# EAGLE design usbif2 (EAGLE 6.5.0)
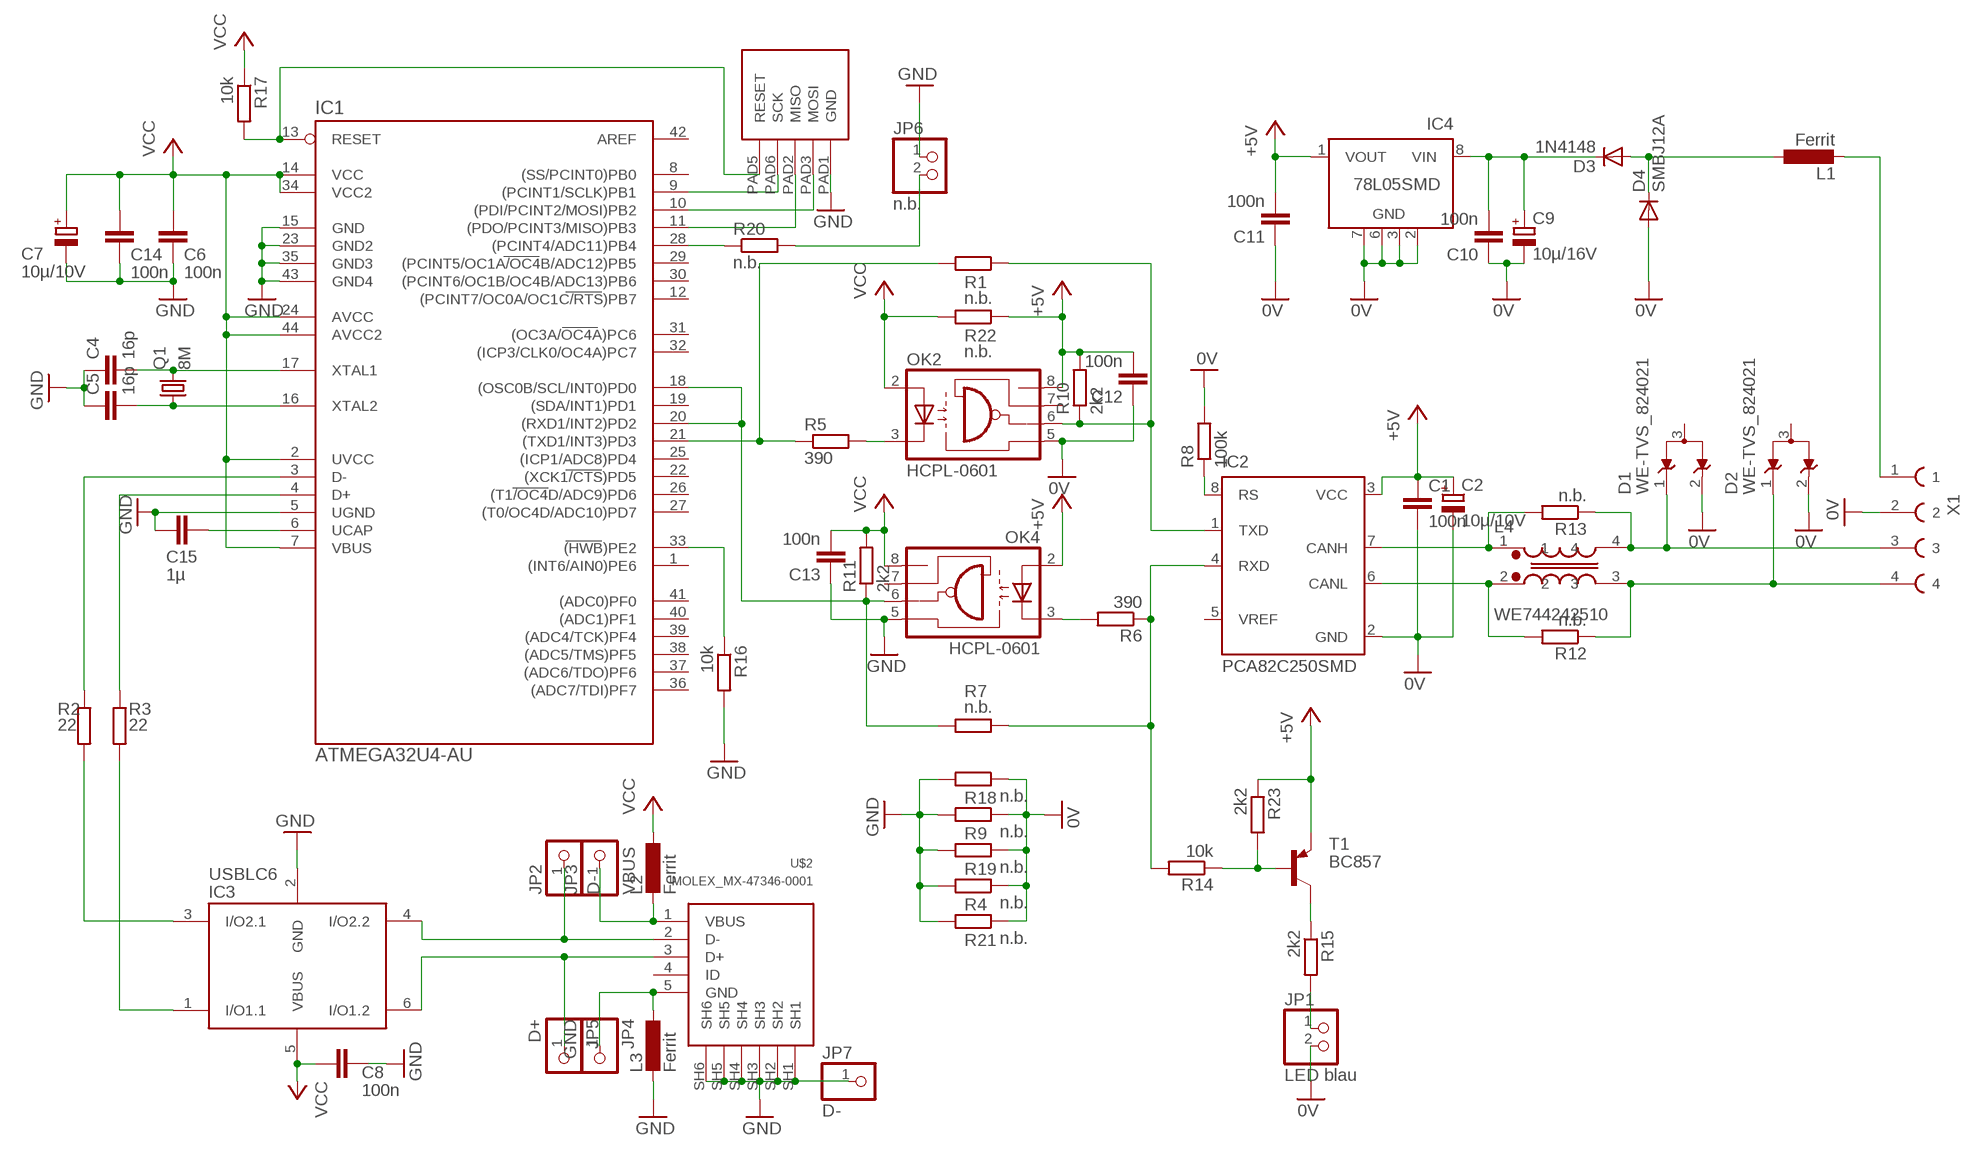
[diagram p0: schematic, sheet 1]

## Parts
C1  100n  C-EUC0603  [C0603]
C2  10µ/10V  CPOL-EUA/3216-18W  [A/3216-18W]
C4  16p  C-EUC0603  [C0603]
C5  16p  C-EUC0603  [C0603]
C6  100n  C-EUC0603  [C0603]
C7  10µ/10V  CPOL-EUA/3216-18W  [A/3216-18W]
C8  100n  C-EUC0603  [C0603]
C9  10µ/16V  CPOL-EUA/3216-18W  [A/3216-18W]
C10  100n  C-EUC0603  [C0603]
C11  100n  C-EUC0603  [C0603]
C12  100n  C-EUC0603  [C0603]
C13  100n  C-EUC0603  [C0603]
C14  100n  C-EUC0603  [C0603]
C15  1µ  C-EUC1210K  [C1210K]
D1  WE-TVS_824021  [WE-TVS_SOT23-3L]
D2  WE-TVS_824021  [WE-TVS_SOT23-3L]
D3  1N4148  DIODE-SOD80C  [SOD80C]
D4  SMBJ12A  DIODE-SMB  [SMB]
IC1  ATMEGA32U4-AU  [TQFP44]
IC2  PCA82C250SMD  [SO8]
IC3  USBLC6  [SOT23-6L]
IC4  78L05SMD  [SO08]
JP1  LED blau  PINHD-1X2  [1X02]
JP2  D-  PINHD-1X1  [1X01]
JP3  VBUS  PINHD-1X1  [1X01]
JP4  GND  PINHD-1X1  [1X01]
JP5  D+  PINHD-1X1  [1X01]
JP6  n.b.  PINHD-1X2  [1X02]
JP7  D-  PINHD-1X1  [1X01]
L1  Ferrit  L-EUL1806  [L1806]
L2  Ferrit  L-EUL1806  [L1806]
L3  Ferrit  L-EUL1806  [L1806]
L4  WE744242510  WE-SLM  [WE-SLM]
OK2  HCPL-0601  HCPL0601  [SOIC08]
OK4  HCPL-0601  HCPL0601  [SOIC08]
Q1  8M  CRYSTALSM49  [SM49]
R1  n.b.  R-EU_MELF0204R  [MINI_MELF-0204R]
R2  22  R-EU_R0603  [R0603]
R3  22  R-EU_R0603  [R0603]
R4  n.b.  R-EU_MELF0204R  [MINI_MELF-0204R]
R5  390  R-EU_R0603  [R0603]
R6  390  R-EU_R0603  [R0603]
R7  n.b.  R-EU_MELF0204R  [MINI_MELF-0204R]
R8  100k  R-EU_R0603  [R0603]
R9  n.b.  R-EU_MELF0204R  [MINI_MELF-0204R]
R10  2k2  R-EU_R0603  [R0603]
R11  2k2  R-EU_R0603  [R0603]
R12  n.b.  R-EU_R0603  [R0603]
R13  n.b.  R-EU_R0603  [R0603]
R14  10k  R-EU_R0603  [R0603]
R15  2k2  R-EU_R0603  [R0603]
R16  10k  R-EU_R0603  [R0603]
R17  10k  R-EU_R0603  [R0603]
R18  n.b.  R-EU_MELF0204R  [MINI_MELF-0204R]
R19  n.b.  R-EU_MELF0204R  [MINI_MELF-0204R]
R20  n.b.  R-EU_R0603  [R0603]
R21  n.b.  R-EU_MELF0204R  [MINI_MELF-0204R]
R22  n.b.  R-EU_MELF0204R  [MINI_MELF-0204R]
R23  2k2  R-EU_R0603  [R0603]
T1  BC857  BC807  [SOT323-BEC]
U$1  ATMEL_ISP  [ATMEL_ISP]
U$2  MOLEX_MX-47346-0001  [MOLEX_MX-47346-0001]
X1  DEGSON_15EDGRC-3.5_4  [DEGSON_15EDGRC-3.5_4]

## Nets
0V: C1.2 C2.- C9.- C10.1 C11.1 C12.1 D1.2 D2.2 D4.A IC2.2(GND) IC4.2(GND) IC4.3(GND) IC4.6(GND) IC4.7(GND) JP1.2 OK2.5(GND) R4.1 R8.2 R9.1 R18.1 R19.1 R21.1 X1.2
#RESET: IC1.13(RESET) R17.2 U$1.PAD5(RESET)
+5V: C1.1 C2.+ C11.2 C12.2 IC2.3(VCC) IC4.1(VOUT) OK2.8(VCC) OK4.2(A) R10.2 R22.1 R23.1 T1.E
+12V: L1.2 X1.1
B+: D1.1 L4.4 R13.1 X1.3
B-: D2.1 L4.3 R12.1 X1.4
D+: IC3.6(I/O1.2) JP5.1 U$2.3(D+)
D-: IC3.4(I/O2.2) JP2.1 U$2.2(D-)
GND: C4.1 C5.1 C6.1 C7.- C8.1 C13.1 C14.1 C15.2 IC1.5(UGND) IC1.15(GND) IC1.23(GND2) IC1.35(GND3) IC1.43(GND4) IC3.2(GND) JP6.1 JP7.1 L3.2 OK4.5(GND) R4.2 R9.2 R16.2 R18.2 R19.2 R21.2 U$1.PAD1(GND) U$2.SH1 U$2.SH2 U$2.SH3 U$2.SH4 U$2.SH5 U$2.SH6
N$1: OK2.3(C) R5.2
N$2: IC1.18((OSC0B/SCL/INT0)PD0) IC1.20((RXD1/INT2)PD2) OK4.6(VO) R7.2 R11.1
N$3: IC2.1(TXD) OK2.6(VO) R1.1 R10.1
N$4: IC2.4(RXD) R6.1 R7.1 R14.2
N$5: IC1.10((PDI/PCINT2/MOSI)PB2) U$1.PAD3(MOSI)
N$6: IC1.11((PDO/PCINT3/MISO)PB3) U$1.PAD2(MISO)
N$7: IC1.9((PCINT1/SCLK)PB1) U$1.PAD6(SCK)
N$9: IC1.4(D+) R3.1
N$10: IC2.7(CANH) L4.1 R13.2
N$11: C15.1 IC1.6(UCAP)
N$12: IC1.3(D-) R2.1
N$13: IC3.1(I/O1.1) R3.2
N$14: IC3.3(I/O2.1) R2.2
N$15: C4.2 IC1.17(XTAL1) Q1.2
N$16: C5.2 IC1.16(XTAL2) Q1.1
N$17: IC2.6(CANL) L4.2 R12.2
N$18: JP6.2 R20.2
N$19: IC1.28((PCINT4/ADC11)PB4) R20.1
N$20: D3.A D4.C L1.1
N$21: C9.+ C10.2 D3.C IC4.8(VIN)
N$22: OK4.3(C) R6.2
N$23: R15.1 T1.C
N$24: IC1.33((HWB)PE2) R16.1
N$25: R14.1 R23.2 T1.B
N$26: JP1.1 R15.2
N$27: IC2.8(RS) R8.1
N$29: JP4.1 L3.1 U$2.5(GND)
N$30: IC1.21((TXD1/INT3)PD3) R1.2 R5.1
VBUS: JP3.1 L2.2 U$2.1(VBUS)
VCC: C6.2 C7.+ C8.2 C13.2 C14.2 IC1.2(UVCC) IC1.7(VBUS) IC1.14(VCC) IC1.24(AVCC) IC1.34(VCC2) IC1.44(AVCC2) IC3.5(VBUS) L2.1 OK2.2(A) OK4.8(VCC) R11.2 R17.1 R22.2
Unconnected: D1.3(GND) D2.3(GND) IC1.1((INT6/AIN0)PE6) IC1.8((SS/PCINT0)PB0) IC1.12((PCINT7/OC0A/OC1C/RTS)PB7) IC1.19((SDA/INT1)PD1) IC1.22((XCK1/CTS)PD5) IC1.25((ICP1/ADC8)PD4) IC1.26((T1/OC4D/ADC9)PD6) IC1.27((T0/OC4D/ADC10)PD7) IC1.29((PCINT5/OC1A/OC4B/ADC12)PB5) IC1.30((PCINT6/OC1B/OC4B/ADC13)PB6) IC1.31((OC3A/OC4A)PC6) IC1.32((ICP3/CLK0/OC4A)PC7) IC1.36((ADC7/TDI)PF7) IC1.37((ADC6/TDO)PF6) IC1.38((ADC5/TMS)PF5) IC1.39((ADC4/TCK)PF4) IC1.40((ADC1)PF1) IC1.41((ADC0)PF0) IC1.42(AREF) IC2.5(VREF) IC4.4(NC) IC4.5(NC) OK2.7(VE) OK4.7(VE) U$2.4(ID)

## Library data of the parts
C1 C4-C6 C8 C10-C15 = resistor:C-EU: CAPACITOR, European symbol
C2 C7 C9 = rcl:CPOL-EU: POLARIZED CAPACITOR, European symbol
D1 D2 = EagleLibrary_Wuerth_Elektronik_eiSos_V6_20140807:WE-TVS_824021: TVS Diode Array WE-TVS, Standard Series - Low capazity - No leakage current - Low clamping voltage - high ESD voltage protection - Uni- and bidirectional protection -- DC Distribution -- Headsets and Accessoires -- PDAs -- Digital Cameras -- MP3-Players -- Touch Panels <http://katalog.we-online.de/media/images/eisos/VarTVS_highspeed_pf2.jpg.jpg> Details see: http://katalog.we-online.de/en/pbs/WE-TVS_High_Speed? Updated by Dan Xu 2014-07-11 2014 (C) Würth Elektronik
D3 D4 = diode:DIODE-: DIODE
IC1 = mega32U4:ATMEGA32U4-AU: ATMega32U4-AU Library by: http://projects.weber-itam.de
IC2 = mylib:PCA82C250: CAN CONTROLLER INTERFACE
IC3 = mylib:USBLC6
IC4 = linear:78L*SMD: Positive VOLTAGE REGULATOR
JP1 JP6 = pinhead:PINHD-1X2: PIN HEADER
JP2-JP5 JP7 = pinhead:PINHD-1X1: PIN HEADER
L1-L3 = mylib:L-EU: INDUCTOR, European symbol
L4 = EagleLibrary_Wuerth_Elektronik_eiSos_V6_20140807:WE-SLM: SMD Common Mode Line Filter WE-SLM - Small size - Low Profile - High Impedance - High current capability up to 300 mA -- USB -- CAN -- Firewire -- Data Lines -- Power supply systems -- Signal Lines <http://katalog.we-online.de/media/images/eisos/IndSLM_pf2.jpg> Details see: http://katalog.we-online.de/en/pbs/WE-SLM?? Updated by Dan Xu 2014-07-11 2014 (C) Würth Elektronik
OK2 OK4 = optocoupler:HCPL0601: HEWLETT PACKARD OPTO COUPLER; MF: AGILENT TECHNOLOGIES; MPN: HCPL-0601-000E; OC_FARNELL: 9995102; OC_NEWARK: 88H7776
Q1 = crystal:CRYSTAL: CRYSTAL; OC_FARNELL: unknown; OC_NEWARK: unknown
R1-R23 = resistor:R-EU_: RESISTOR, European symbol
T1 = mylib:BC807
U$1 = mylib:ATMEL_ISP
U$2 = mylib:MOLEX_MX-47346-0001
X1 = mylib:DEGSON_15EDGRC-3.5_4

## Net classes
0 default: clearance 0.205 mm

## Board
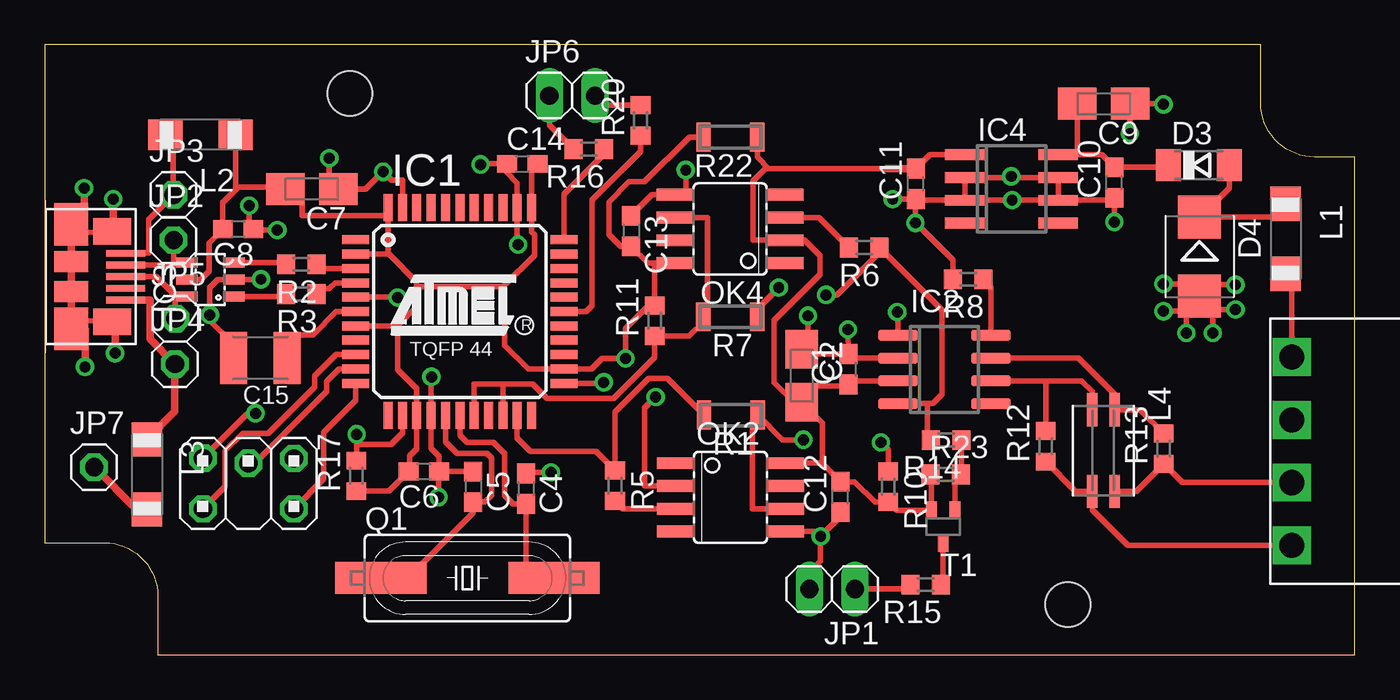
[diagram p1: board, top side]
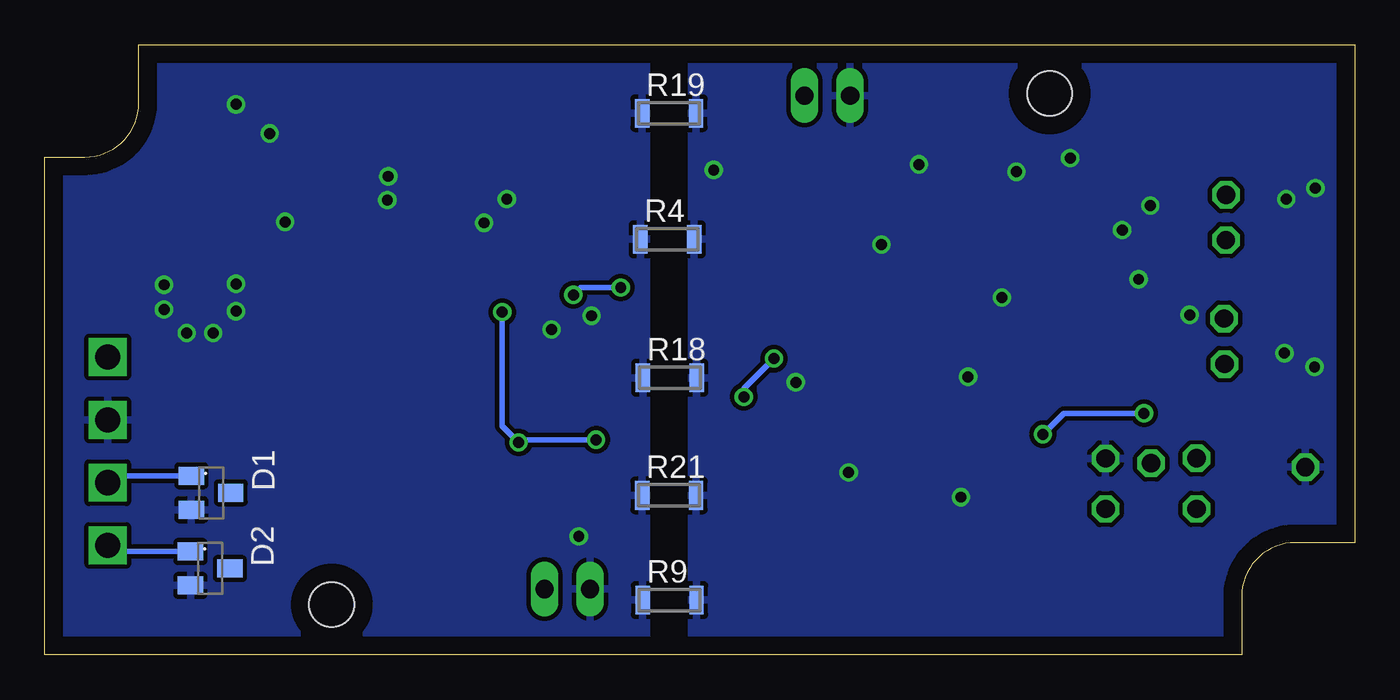
[diagram p2: board, bottom side, seen from below]

Size 72.98 x 34 mm. Coordinates in mm from the lower left corner, seen from the top.
Outline: 0,34 0,6.25 3.3,6.25 arc-90 6.3,3.25 6.3,0 72.98,0 72.98,27.75 70.75,27.75 arc-90 67.75,30.75 67.75,34 0,34
Copper layers (1*16): Top 0.035mm / dielectric 1.5mm / Bottom 0.035mm
Design rules "Bilex DRU": minimum track width 10mil, minimum drill 24mil, track to track 10mil, track to pad 10mil, pad to pad 10mil, via to via 10mil, smd to smd 10mil, copper to edge 40mil, drill to drill 8mil, minimum pad ring 10mil, minimum via ring 8mil, stop-mask expansion 4mil, vias tented up to drill 0mil, thermal gap 10mil
Holes 2.5 mm at 57,2.8 17,31.3

### Footprints (pad centres in the part's own frame; a part is rotated, then mirrored left to right if it is on the bottom)
C0603 = smd 1.1 x 1: 1 -0.85,0; 2 0.85,0
A/3216-18W = smd 2.15 x 1.8: + 1.475,0; - -1.475,0
C1210K = smd 1.5 x 2.9: 1 -1.5,0; 2 1.5,0
WE-TVS_SOT23-3L = smd 1 x 1.4: 1 -0.95,-1.1; 2 0.95,-1.1; 3 0,1.1
SOD80C = smd 1.4 x 1.8: A 1.7,0; C -1.7,0
SMB = smd 2.4 x 2.4: A 2.2,0; C -2.2,0
TQFP44 = smd 1.5 x 0.5: 1 -5.8,4; 2 -5.8,3.2; 3 -5.8,2.4; 4 -5.8,1.6; 5 -5.8,0.8; 6 -5.8,0; 7 -5.8,-0.8; 8 -5.8,-1.6; 9 -5.8,-2.4; 10 -5.8,-3.2; 11 -5.8,-4; 23 5.8,-4; 24 5.8,-3.2; 25 5.8,-2.4; 26 5.8,-1.6; 27 5.8,-0.8; 28 5.8,0; 29 5.8,0.8; 30 5.8,1.6; 31 5.8,2.4; 32 5.8,3.2; 33 5.8,4 | smd 0.5 x 1.5: 12 -4,-5.8; 13 -3.2,-5.8; 14 -2.4,-5.8; 15 -1.6,-5.8; 16 -0.8,-5.8; 17 0,-5.8; 18 0.8,-5.8; 19 1.6,-5.8; 20 2.4,-5.8; 21 3.2,-5.8; 22 4,-5.8; 34 4,5.8; 35 3.2,5.8; 36 2.4,5.8; 37 1.6,5.8; 38 0.8,5.8; 39 0,5.8; 40 -0.8,5.8; 41 -1.6,5.8; 42 -2.4,5.8; 43 -3.2,5.8; 44 -4,5.8
SO8 = smd 0.6 x 2.2: 1 -1.905,-2.6; 2 -0.635,-2.6; 3 0.635,-2.6; 4 1.905,-2.6; 5 1.905,2.6; 6 0.635,2.6; 7 -0.635,2.6; 8 -1.905,2.6
SOT23-6L = smd 0.55 x 1.2: 1 -0.95,-1.3; 2 0,-1.3; 3 0.95,-1.3; 4 0.95,1.3; 5 0,1.3; 6 -0.95,1.3
SO08 = smd 0.6 x 2.2: 1 -1.905,-2.6; 2 -0.635,-2.6; 3 0.635,-2.6; 4 1.905,-2.6; 5 1.905,2.6; 6 0.635,2.6; 7 -0.635,2.6; 8 -1.905,2.6
1X02 = drill 1.016 long: 1 -1.27,0; 2 1.27,0
1X01 = drill 1.016 octagon: 1 0,0
L1806 = smd 1.9 x 1.7: 1 -0.68,0; 2 3.22,0
WE-SLM = smd 1.85 x 0.6: 1 -2.28,0.63; 2 -2.28,-0.62; 3 2.27,-0.62; 4 2.27,0.63
SOIC08 = smd 0.66 x 2.032: 1 -1.905,-3.073; 2 -0.635,-3.073; 3 0.635,-3.073; 4 1.905,-3.073; 5 1.905,3.073; 6 0.635,3.073; 7 -0.635,3.073; 8 -1.905,3.073
SM49 = smd 5.08 x 1.778: 1 -4.826,0; 2 4.826,0
MINI_MELF-0204R = smd 0.8 x 1.6: 1 -1.5,0; 2 1.5,0
R0603 = smd 1 x 1.1: 1 -0.85,0; 2 0.85,0
SOT323-BEC = smd 0.6 x 1: B -0.65,-0.9; C 0,0.9; E 0.65,-0.9
ATMEL_ISP = drill 1.016 octagon: PAD1 1.397,-2.54; PAD2 -1.41,-2.54; PAD3 1.13,0; PAD5 1.41,2.54; PAD6 -1.41,2.54
MOLEX_MX-47346-0001 = smd 2.159 x 0.381: 1 3.991,1.3; 2 3.991,0.65; 3 3.991,0; 4 3.991,-0.65; 5 3.991,-1.3 | smd 1.9 x 2.375: SH1 0.95,2.91; SH4 0.95,-2.91 | smd 1.9 x 1.175: SH2 0.95,0.84; SH3 0.95,-0.84 | smd 2.1 x 1.475: SH5 3.25,2.511; SH6 3.25,-2.511
DEGSON_15EDGRC-3.5_4 = drill 1.4 square: 1 2.15,1.2; 2 5.65,1.2; 3 9.15,1.2; 4 12.65,1.2

### Placement (x,y rotation side)
C1  44.77,15.92 90 top
C2  42.17,15.56 270 top
C4  26.81,9.26 270 top
C5  23.87,9.36 270 top
C6  21.12,10.21 180 top
C7  14.88,25.96 180 top
C8  10.77,23.72 180 top
C9  59,30.72 180 top
C10  59.59,26.32 90 top
C11  48.53,26.24 90 top
C12  44.33,8.8 90 top
C13  32.66,23.62 270 top
C14  26.61,27.37 0 top
C15  12.01,16.54 180 top
D1  63.72,9.03 270 bottom
D2  63.77,4.81 270 bottom
D3  64.3,27.3 0 top
D4  64.34,22.2 270 top
IC1  23.12,19.13 0 top
IC2  50.12,15.9 270 top
IC3  9.22,20.92 90 top
IC4  53.87,25.97 270 top
JP1  43.87,3.67 180 top
JP2  7.17,23.12 0 top
JP3  7.16,25.63 0 top
JP4  7.24,16.21 0 top
JP5  7.27,18.74 0 top
JP6  29.38,31.17 0 top
JP7  2.74,10.46 0 top
L1  69.14,24.46 270 top
L2  9.94,28.99 180 top
L3  5.69,11.33 270 top
L4  58.98,11.38 270 top
OK2  38.2,8.78 270 top
OK4  38.18,23.74 90 top
Q1  23.54,4.28 0 top
R1  38.23,13.37 180 top
R2  14.3,21.76 180 top
R3  14.3,20.11 180 top
R4  38.3,23.16 0 bottom
R5  31.78,9.42 270 top
R6  45.65,22.69 180 top
R7  38.2,18.85 180 top
R8  51.45,20.94 180 top
R9  38.17,3.06 0 bottom
R10  47,9.37 270 top
R11  33.99,18.62 90 top
R12  55.77,11.62 90 top
R13  62.34,11.49 90 top
R14  50.22,11.97 180 top
R15  49.09,3.91 180 top
R16  30.31,28.19 180 top
R17  17.36,9.97 90 top
R18  38.16,15.44 0 bottom
R19  38.2,30.18 0 bottom
R20  33.19,29.78 90 top
R21  38.2,8.89 0 bottom
R22  38.2,28.85 180 top
R23  50.19,10.06 0 top
T1  50.06,7.14 180 top
U$1  11.34,9.55 90 top
U$2  0.51,21.08 0 top
X1  68.28,18.75 270 top

### Tracks (layer width: path | path; a pad name or v marks a point on that pad's centre or on a via)
0V  (via drill 0.61)
  Top 0.305: IC4.6 59.45,25.33 | IC4.6 IC4.7 IC4.2 IC4.3 48.59,25.33 | IC2.2 45,16.54 | v44.76,18.14 C1.2 42.44,16.77 C2.- 42.52,17.38 v42.52,18.9 | IC4.6 56.47,25.35 56.44,25.35 | 51.26,25.4 51.31,25.35 v53.9,25.35 56.39,25.35 56.44,25.4 | v62.33,20.68 64.34,20.68 D4.A | v62.33,19.15 64.41,19.15 64.41,19.25 | v66.34,20.62 64.36,20.62 64.36,19.91 | v66.34,19.25 64.41,19.25 | 64.41,19.25 64.41,19.96 | v65.08,17.93 65.08,19.96 64.41,19.96 | v63.6,17.93 63.6,19.96 64.41,19.96 | 60.45,30.7 v60.45,29.06 | v62.33,30.68 62.33,30.72 C9.- | C10.1 59.59,24.23 v59.59,24.13 | C11.1 48.51,25.4 | 48.51,25.4 v47.24,25.4 | 48.51,25.4 v48.51,24.08 50.6,22 R8.2 | OK2.5 42.96,6.87 v43.23,6.6 | C12.1 44.33,7.7 v43.23,6.6 | JP1.2 42.6,4.6 43.23,5.23 v43.23,6.6
  Top 0.406: 48.59,25.33 C11.1 | 56.44,25.33 56.44,25.35 | 45,16.54 C1.2
  other vias: 53.85,26.67
  pour Bottom: 39.45,33.8 72.78,33.8 72.78,0.2 39.45,0.2
#RESET  (via drill 0.61)
  Top 0.305: U$1.PAD5 11.31,13.46 v11.73,13.46 | v17.37,12.29 17.37,11.58 | 17.37,11.58 17.37,10.84 R17.2 | IC1.13 19.93,12.36 19.3,11.73 17.53,11.73 17.37,11.58
  Bottom 0.305: v11.73,13.46 16.2,13.46 v17.37,12.29
+5V
  Top 0.305: IC4.1 49.31,27.87 C11.2 | IC2.3 44.97,15.27 | OK2.8 43.3,10.68 43.32,10.66 | 43.32,10.66 C12.2 45.11,9.65 46.24,8.52 R10.2 47.47,8.04 T1.E 49.41,10.06 R23.1 | C2.+ 42.17,14.49 42.67,14.99 44.4,14.99 44.48,15.07 C1.1 | C2.+ 43.32,12.94 43.32,10.66 | C2.+ 41.75,14.08 40.64,15.19 40.64,18.64 43.18,21.18 43.18,22.25 42.33,23.1 OK4.2 39.47,23.1 39.47,26.42 40.15,27.09 40.34,27.09 | 46.91,27.09 40.34,27.09 | R22.1 39.7,27.73 40.34,27.09
  Top 0.406: C11.2 46.91,27.09 | 44.97,15.27 C1.1
+12V
  Top 0.305: X1.1 69.48,20.9 L1.2
B+
  Top 0.305: L4.4 60.81,9.11 R13.1 63.39,9.6 X1.3
  Bottom 0.305: D1.1 69.09,9.98 X1.3
B-
  Top 0.305: X1.4 60.35,6.1 58.36,8.09 L4.3 57.42,9.11 R12.1
  Bottom 0.305: D2.1 69.14,5.76 X1.4
D+
  Top 0.305: U$2.3 6.2,21.08 7.31,19.97 IC3.6 7.27,19.97 JP5.1
D-
  Top 0.305: 7.42,21.89 7.9,21.89 IC3.4 7.92,21.73 7.32,21.73 7.17,21.73 | U$2.2 7.17,21.73 | JP2.1 7.17,21.73
GND  (via drill 0.61)
  Top 0.305: v21.95,8.79 21.95,10.21 | C4.1 26.8,10.16 v28.19,10.16 | 21.95,10.21 C6.1 21.97,11.05 21.52,11.49 IC1.15 21.52,15.48 v21.54,15.49 | 21.95,10.21 C5.1 | U$2.SH1 1.91,23.54 U$2.SH5 | U$2.SH4 1.91,18.62 U$2.SH6 | IC3.2 9.64,20.92 9.2,20.47 v9.2,18.95 9.2,18.64 10.51,17.33 C15.2 | IC1.43 19.93,26.46 19.32,26.46 v18.85,26.92 17.88,25.96 C7.- 16.26,26.52 | v24.28,27.33 24.32,27.36 C14.1 25.76,26.87 26.32,26.3 IC1.35 26.32,22.9 v26.36,22.86 | IC1.5 19.64,19.93 v19.66,19.91 | IC1.23 31.09,15.13 v31.14,15.19 | v12.04,20.93 10.57,20.93 | R16.2 28.11,29.53 JP6.1 | C13.1 33.84,25.64 OK4.5 35.71,25.64 v35.71,27.03 | 15.65,25.91 15.85,26.11 v15.85,27.69 | C8.1 11.38,23.96 v11.38,25.04 | v12.95,23.67 11.63,23.67 11.63,23.72
  Top 0.406: L3.2 5.1,8.11 JP7.1 | U$2.SH5 3.81,23.64 v3.81,25.4 | v2.18,26.01 2.18,23.99 U$2.SH1 U$2.SH2 U$2.SH3 U$2.SH4 2.23,18.17 v2.23,16.05 | U$2.SH6 arc-90 3.91,18.42 v3.91,16.82
  pour Bottom: 0.19,33.81 36.95,33.81 36.95,0.19 0.19,0.19 0.19,33.05
N$1
  Top 0.305: OK2.3 32.21,8.14 R5.2
N$2
  Top 0.305: IC1.18 23.93,15.09 25.52,15.09 | 25.52,15.09 IC1.20 | 25.52,15.09 27.18,15.09 27.99,14.28 31.7,14.28 33.98,16.56 R11.1 35.9,17.77 36.7,18.56 R7.2 36.93,18.85 36.93,24.37 OK4.6
N$3  (via drill 0.61)
  Top 0.305: OK2.6 39.42,8.14 39.42,13.06 R1.1 41.1,11.99 v42.27,11.99 | IC2.1 47.52,19.07 v47.5,19.1 | R10.1 47,11.42 v46.58,11.84
  Bottom 0.305: v47.5,19.1 47.5,12.75 v46.58,11.84 46.43,11.99 v42.27,11.99
N$4  (via drill 0.61)
  Top 0.305: IC2.4 49.17,14 | 49.17,14 49.48,14 49.99,14.51 49.99,19.21 R6.1 46.5,22.42 44.15,20.07 v43.54,20.07 | R7.1 39.7,19.27 v40.89,20.47 | R14.2 49.17,11.97 49.17,14
  Bottom 0.305: v40.89,20.47 43.13,20.47 v43.54,20.07
N$5
  Top 0.305: U$1.PAD3 11.69,10.68 15.7,14.68 15.7,15.24 16.39,15.94 IC1.10
N$6
  Top 0.305: IC1.11 17.32,14.18 15.54,12.39 15.54,9.8 U$1.PAD2
N$7
  Top 0.305: U$1.PAD6 10.06,9.39 10.06,11.38 11.02,12.34 12.45,12.34 15.04,14.94 15.04,15.54 16.23,16.73 IC1.9
N$9
  Top 0.305: IC1.4 16.16,20.73 15.85,20.42 15.46,20.42 R3.1
N$10
  Top 0.305: IC2.7 57.58,16.54 59.64,14.48 59.64,13.69 L4.1 61.02,13.66 R13.2
N$11
  Top 0.305: IC1.6 16.24,19.14 14.94,17.83 14.17,17.83 14.02,17.68 14.02,16.7 C15.1
N$12
  Top 0.305: IC1.3 15.38,21.54 R2.1
N$13
  Top 0.305: IC3.1 13.31,19.97 R3.2
N$14
  Top 0.305: IC3.3 13.35,21.87 R2.2
N$15
  Top 0.305: Q1.2 26.8,4.28 C4.2 26.08,8.41 25.6,8.89 25.6,11.23 24.99,11.84 23.52,11.84 23.12,12.23 IC1.17
N$16
  Top 0.305: IC1.16 22.32,11.86 22.96,11.23 24.64,11.23 24.89,10.97 24.89,8.89 24.51,8.51 C5.2 23.87,7.92 20.23,4.28 Q1.1
N$17
  Top 0.305: IC2.6 55.88,15.27 | 55.88,15.27 57.76,15.27 58.36,14.67 L4.2 | R12.2 55.77,15.15 55.88,15.27
N$18
  Top 0.305: R20.2 31.2,30.63 JP6.2
N$19
  Top 0.305: IC1.28 30.16,19.14 30.48,19.46 30.48,25.35 33.19,28.06 R20.1
N$20
  Top 0.305: D3.A 66,26.02 65.33,25.35 65.33,24.7 65.02,24.4 | 65.02,24.4 68.4,24.4 L1.1 | D4.C 65.02,24.4
  Top 1.016: 63.74,24.4 D4.C
N$21
  Top 0.305: 62.48,27.17 C10.2 58.89,27.87 IC4.8 57.52,27.87 C9.+
  Top 0.406: 62.48,27.17 D3.C
N$22
  Top 0.305: OK4.3 43.12,24.37 R6.2
N$23
  Top 0.305: T1.C 50.05,4.03 R15.1
N$24
  Top 0.305: IC1.33 28.93,25.67 31.16,27.91 R16.1
N$25
  Top 0.305: R14.1 51.07,10.06 R23.2 50.7,9.72 T1.B
N$26
  Top 0.305: JP1.1 47.99,3.67 R15.2
N$27
  Top 0.305: IC2.8 52.73,20.51 R8.1
N$29
  Top 0.406: U$2.5 5.86,19.78 5.86,17.59 JP4.1 7.24,13.56 L3.1
N$30
  Top 0.305: IC1.21 26.32,12.08 27.08,11.33 30.72,11.33 R5.1 31.77,13.54 33.63,15.39 34.7,15.39 R1.2
VBUS
  Top 0.305: U$2.1 5.79,22.38 5.79,24.26 JP3.1 7.16,28.55 L2.2
VCC  (via drill 0.61)
  Top 0.305: IC3.5 8.68,20.92 9.14,21.39 9.14,22.95 C8.2 9.92,25.21 10.69,25.98 | C14.2 27.12,27.03 IC1.34 27.12,23.57 27.28,23.42 27.28,22.25 25.63,20.6 | 20.73,20.52 20.73,20.78 19.17,22.34 IC1.2 19.12,22.34 IC1.44 19.12,24.49 14.33,24.49 14.33,25.5 13.4,25.5 C7.+ 13.3,26.06 10.77,26.06 10.69,25.98 | 20.73,20.52 20.73,19.41 19.66,18.34 | 19.66,18.34 IC1.7 | 19.66,18.34 19.66,15.9 20.73,14.84 IC1.14 20.73,11.48 20.32,11.07 20.32,10.27 C6.2 19.18,9.12 R17.1 | 25.63,20.6 25.55,20.52 20.73,20.52 | 25.63,20.6 25.63,17.25 26.94,15.94 IC1.24 30.46,15.94 31.04,16.51 v32.36,16.51 32.36,18.19 33.64,19.47 R11.2 33.98,21.83 | OK2.2 33.43,9.41 33.43,13.77 v34.04,14.38 | R22.2 35.92,28.85 33.43,26.36 32.56,26.36 31.45,25.25 31.45,23.42 32.09,22.77 C13.2 33.6,21.83 33.98,21.83 | 33.98,21.83 OK4.8 | L2.1 10.62,26.06 10.69,25.98
  Bottom 0.305: v32.36,16.51 34.04,14.83 v34.04,14.38